# EAGLE design WireToPlug (EAGLE 7.4.0)
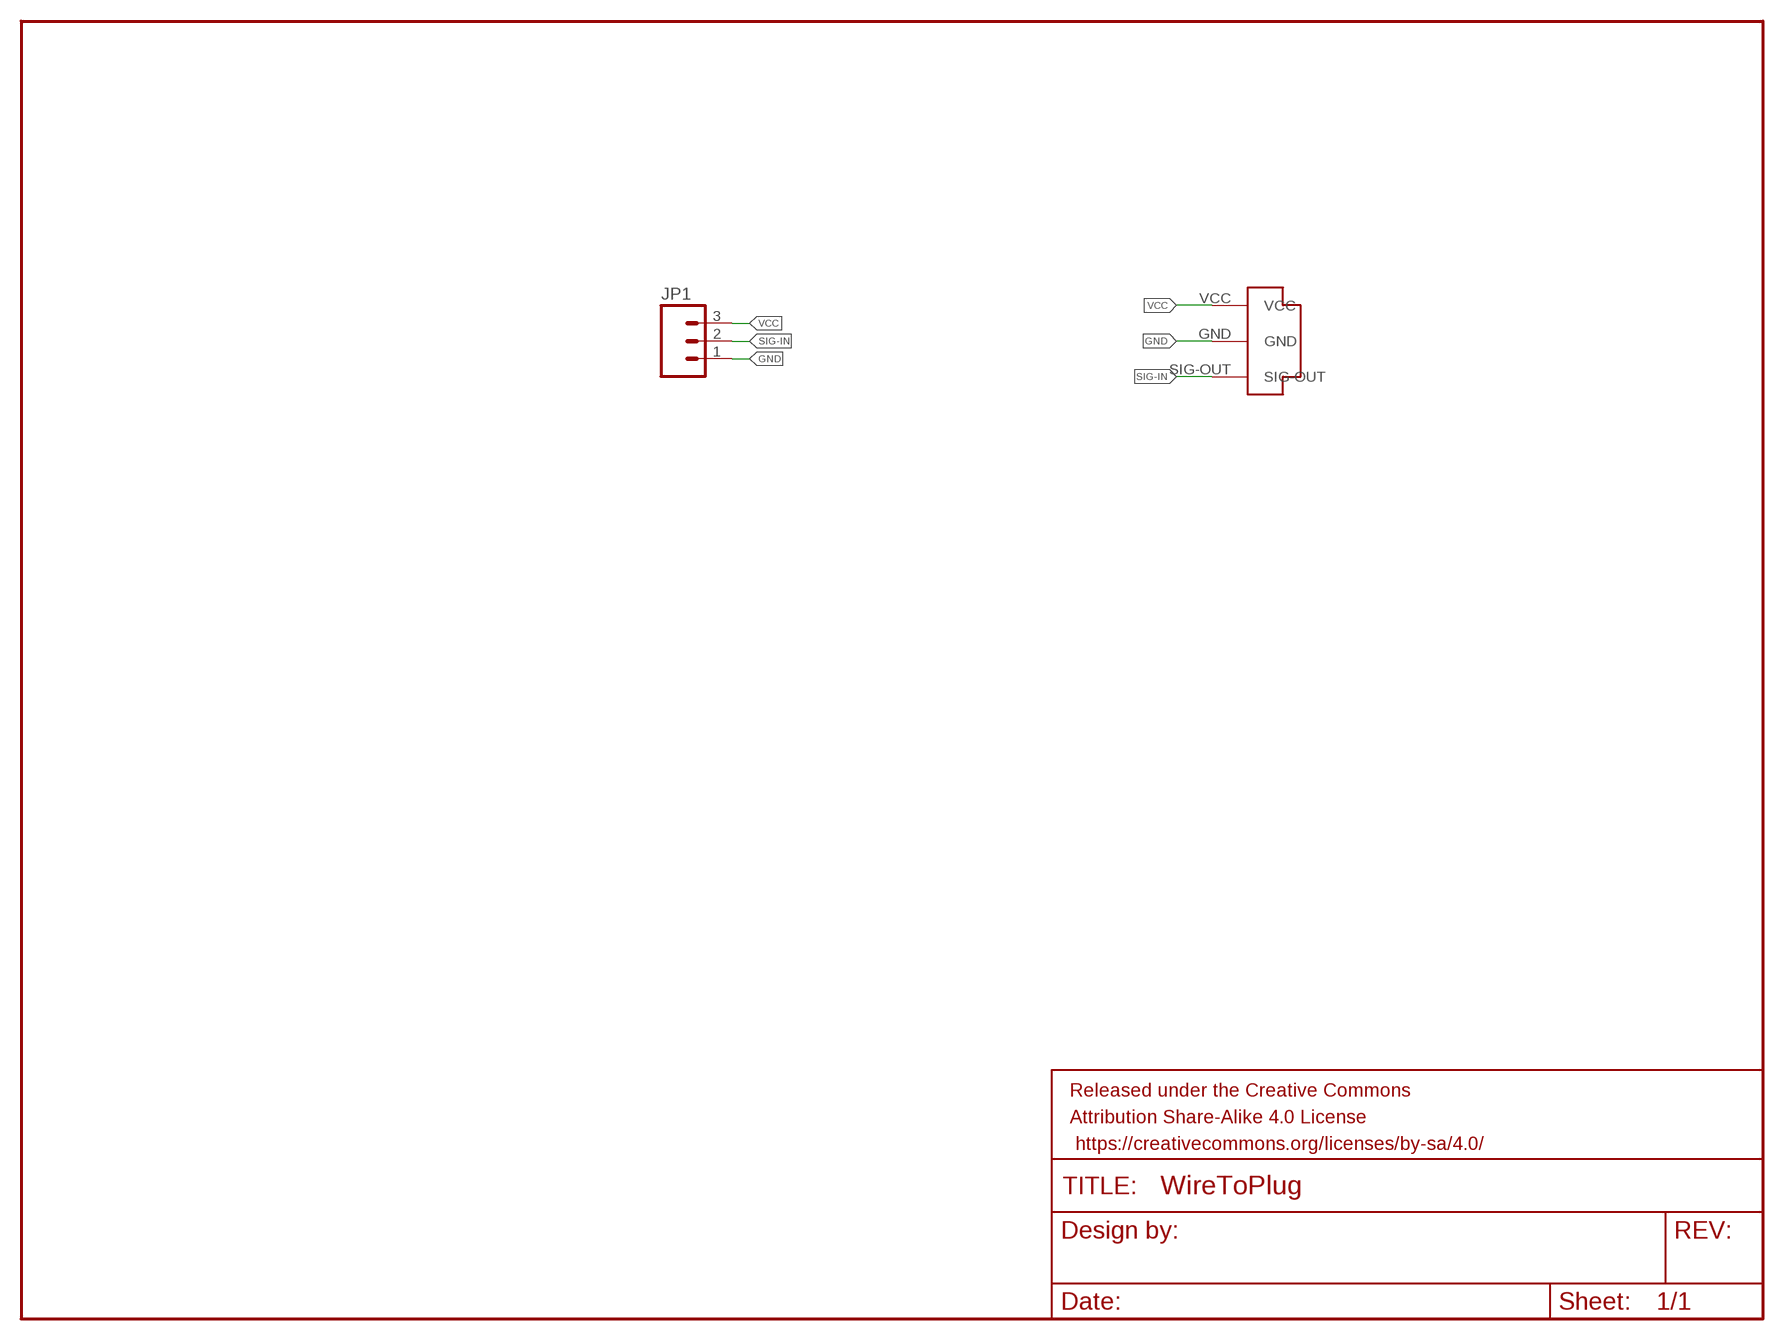
[diagram p0: schematic, sheet 1]

## Parts
FRAME1  FRAME-LETTERNO_PACKAGE  [DUMMY]
JP1  M03SMD  [1X03-1MM-RA]
U$1  CONN-PLUG-3POS-3MM  [PLUG-3POS-3MM-SMD]

## Nets
GND: JP1.1 U$1.GND
SIG-IN: JP1.2 U$1.SIG-OUT
VCC: JP1.3 U$1.VCC

## Library data of the parts
FRAME1 = SparkFun-Aesthetics:FRAME-LETTER: Schematic Frame Standard 8.5x11 US Letter frame; DESIGNER: Nobody; VERSION: v01
JP1 = SparkFun-Connectors:M03: Header 3 Standard 3-pin 0.1" header. Use with straight break away headers (SKU : PRT-00116), right angle break away headers (PRT-00553), swiss pins (PRT-00743), machine pins (PRT-00117), and female headers (PRT-00115). Molex polarized connector foot print use with SKU : PRT-08232 with associated crimp pins and housings.
U$1 = EmbeddedPlayground:CONN-PLUG-3POS-3MM: Surface mount board to board connector. Female socket, 3 position.

## Board
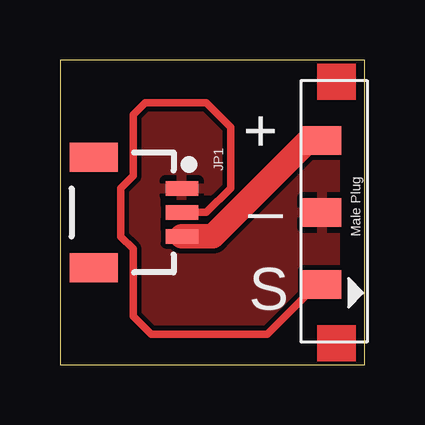
[diagram p1: board, top side]
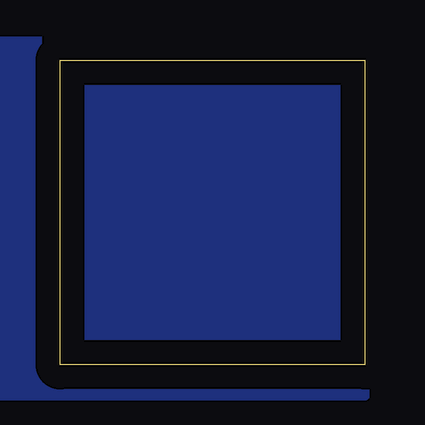
[diagram p2: board, bottom side, seen from below]

Size 12.7 x 12.7 mm. Coordinates in mm from the lower left corner, seen from the top.
Outline: 0,0 12.7,0 12.7,12.7 0,12.7 0,0
Copper layers (1*16): Top 0.035mm / dielectric 1.5mm / Bottom 0.035mm
Design rules "default": minimum track width 10mil, minimum drill 24mil, track to track 8mil, track to pad 8mil, pad to pad 8mil, via to via 8mil, smd to smd 8mil, copper to edge 40mil, drill to drill 8mil, minimum pad ring 10mil, minimum via ring 8mil, stop-mask expansion 4mil, vias tented up to drill 0mil, thermal gap 10mil

### Footprints (pad centres in the part's own frame; a part is rotated, then mirrored left to right if it is on the bottom)
1X03-1MM-RA = smd 0.6 x 1.35: 1 -1,0; 2 0,0; 3 1,0 | smd 1.2 x 2: NC1 2.3,-3.675; NC2 -2.3,-3.675
PLUG-3POS-3MM-SMD = smd 1.2 x 1.6: GND 0,0; SIG-OUT 3,0; VCC -3,0

### Placement (x,y rotation side)
FRAME1  0,0 0 top
JP1  5.08,6.35 270 top
U$1  10.92,6.35 270 top

### Tracks (layer width: path | path; a pad name or v marks a point on that pad's centre or on a via)
GND
  pour Top: 0,12.95 0,-1.27 26.67,-1.27 26.67,12.95
  pour Bottom: 0,13.46 26.67,13.46 26.67,-1.27 0,-1.27
SIG-IN
  Top 0.305: U$1.SIG-OUT 10.72,3.35 8.64,1.27 3.81,1.27 3.05,2.03 3.05,4.83 2.54,5.33 2.54,7.37 3.05,7.87 3.05,10.41 3.56,10.92 6.1,10.92 7.11,9.91 7.11,7.37 6.1,6.35 JP1.2
VCC
  Top 1.016: JP1.3 6.37,5.35 10.41,9.4 10.87,9.4 U$1.VCC

### Text on the board
tPlace: + | _ | S